# EAGLE design ATMegaBoard (EAGLE 9.5.0)
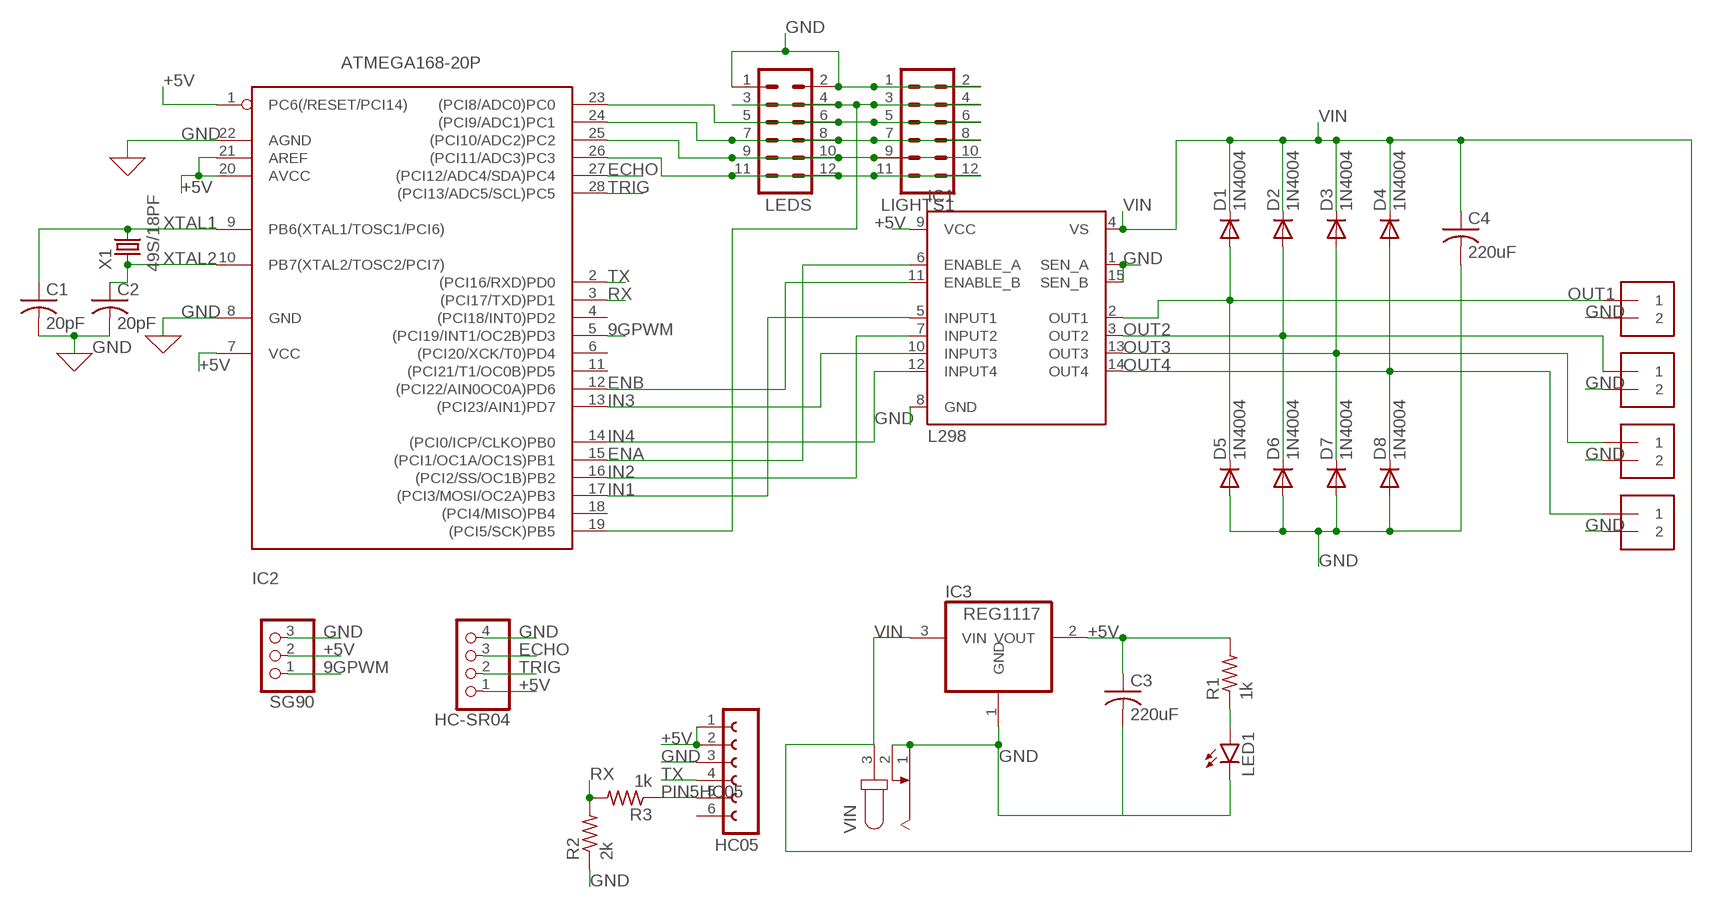
[diagram p0: schematic, sheet 1]

## Parts
C1  20pF  C-US050-024X044  [C050-024X044]
C2  20pF  C-US050-024X044  [C050-024X044]
C3  220uF  C-US050-024X044  [C050-024X044]
C4  220uF  C-US050-024X044  [C050-024X044]
D1  1N4004  [DO41-10]
D2  1N4004  [DO41-10]
D3  1N4004  [DO41-10]
D4  1N4004  [DO41-10]
D5  1N4004  [DO41-10]
D6  1N4004  [DO41-10]
D7  1N4004  [DO41-10]
D8  1N4004  [DO41-10]
HC05  FE06W  [FE06W]
HC-SR04  PINHD-1X4  [1X04]
IC1  L298  [MULTIWATT-15]
IC2  ATMEGA168-20P  [DIL28-3]
IC3  REG1117  [SOT223]
LED1  LED5MM  [LED5MM]
LEDS  MA06-2  [MA06-2]
LIGHTS1  MA06-2  [MA06-2]
OUT1  1X2-3.5MM  [1X2-3.5MM]
OUT2  1X2-3.5MM  [1X2-3.5MM]
OUT3  1X2-3.5MM  [1X2-3.5MM]
OUT4  1X2-3.5MM  [1X2-3.5MM]
R1  1k  R-US_0207/10  [0207/10]
R2  2k  R-US_0207/10  [0207/10]
R3  1k  R-US_0207/10  [0207/10]
SG90  PINHD-1X3  [1X03]
VIN  JACK-PLUG1  [SPC4078]
X1  49S/18PF  [XTAL_HC49]

## Nets
9GPWM: IC2.5((PCI19/INT1/OC2B)PD3) SG90.1
+5V [5v]: C3.1 HC05.1 HC05.2 HC-SR04.1 IC1.9(VCC) IC2.1(PC6(/RESET/PCI14)) IC2.7(VCC) IC2.20(AVCC) IC2.21(AREF) IC3.2(VOUT) R1.2 SG90.2
ECHO: HC-SR04.3 IC2.27((PCI12/ADC4/SDA)PC4)
ENA: IC1.6(ENABLE_A) IC2.15((PCI1/OC1A/OC1S)PB1)
ENB: IC1.11(ENABLE_B) IC2.12((PCI22/AIN0OC0A)PD6)
GND [Power]: C1.2 C2.2 C3.2 C4.2 D5.A D6.A D7.A D8.A HC05.3 HC-SR04.4 IC1.1(SEN_A) IC1.8(GND) IC1.15(SEN_B) IC2.8(GND) IC2.22(AGND) IC3.1(GND) LED1.K(C) LEDS.1 LEDS.2 LIGHTS1.1 LIGHTS1.2 OUT1.2 OUT2.2 OUT3.2 OUT4.2 R2.1 SG90.3 VIN.1 VIN.2
IN1: IC1.5(INPUT1) IC2.17((PCI3/MOSI/OC2A)PB3)
IN2: IC1.7(INPUT2) IC2.16((PCI2/SS/OC1B)PB2)
IN3: IC1.10(INPUT3) IC2.13((PCI23/AIN1)PD7)
IN4: IC1.12(INPUT4) IC2.14((PCI0/ICP/CLKO)PB0)
N$2: IC2.23((PCI8/ADC0)PC0) LEDS.5 LEDS.6 LIGHTS1.5 LIGHTS1.6
N$3: LED1.A R1.1
N$4: IC2.24((PCI9/ADC1)PC1) LEDS.7 LEDS.8 LIGHTS1.7 LIGHTS1.8
N$5: IC2.25((PCI10/ADC2)PC2) LEDS.9 LEDS.10 LIGHTS1.9 LIGHTS1.10
N$6: IC2.19((PCI5/SCK)PB5) LEDS.3 LEDS.4 LIGHTS1.3 LIGHTS1.4
N$7: IC2.26((PCI11/ADC3)PC3) LEDS.11 LEDS.12 LIGHTS1.11 LIGHTS1.12
OUT1 [Power]: D1.A D5.C IC1.2(OUT1) OUT1.1
OUT2 [Power]: D2.A D6.C IC1.3(OUT2) OUT2.1
OUT3 [Power]: D3.A D7.C IC1.13(OUT3) OUT3.1
OUT4 [Power]: D4.A D8.C IC1.14(OUT4) OUT4.1
PIN5HC05: HC05.5 R3.1
RX: IC2.3((PCI17/TXD)PD1) R2.2 R3.2
TRIG: HC-SR04.2 IC2.28((PCI13/ADC5/SCL)PC5)
TX: HC05.4 IC2.2((PCI16/RXD)PD0)
VIN [Power]: C4.1 D1.C D2.C D3.C D4.C IC1.4(VS) IC3.3(VIN) VIN.3
XTAL1: C1.1 IC2.9(PB6(XTAL1/TOSC1/PCI6)) X1.2
XTAL2: C2.1 IC2.10(PB7(XTAL2/TOSC2/PCI7)) X1.1
Unconnected: HC05.6 IC2.4((PCI18/INT0)PD2) IC2.6((PCI20/XCK/T0)PD4) IC2.11((PCI21/T1/OC0B)PD5) IC2.18((PCI4/MISO)PB4)

## Library data of the parts
C1-C4 = rcl:C-US: CAPACITOR, American symbol; SPICEPREFIX: C
D1-D8 = adafruit:1N4004: DIODE General purpose 1N400x type rectifier (With bigger pads) http://www.ladyada.net/library/pcb/eaglelibrary.html
HC05 = con-lsta:FE06W: FEMALE HEADER; OC_FARNELL: unknown; OC_NEWARK: unknown
HC-SR04 = pinhead:PINHD-1X4: PIN HEADER
IC1 = st-microelectronics:L298: DUAL FULL-BRIDGE DRIVER; MPN: L298N; OC_FARNELL: 1589425; OC_NEWARK: 32M1527
IC2 = adafruit:ATMEGA168*P: MICROCONTROLLER 16 kBytes FLASH 1 kBytes SRAM 512 Bytes EEPROM USART 8-channel 10 bit ADC
IC3 = burr-brown:REG1117: 800mA and 1A Low Dropout (LDO) Positive Regulator 1.8V, 2.5V, 2.85V, 3.3V, 5V, and Adj; MPN: REG1117; OC_FARNELL: 1097566; OC_NEWARK: 14P6981
LED1 = led:LED: LED OSRAM: - CHIPLED LG R971, LG N971, LY N971, LG Q971, LY Q971, LO R971, LY R971 LH N974, LH R974 LS Q976, LO Q976, LY Q976 LO Q996 - Hyper CHIPLED LW Q18S LB Q993, LB Q99A, LB R99A - SideLED LS A670, LO A670, LY A670, LG A670, LP A670 LB A673, LV A673, LT A673, LW A673 LH A674 LY A675 LS A676, LA A676, LO A676, LY A676, LW A676 LS A679, LY A679, LG A679 - Hyper Micro SIDELED® LS Y876, LA Y876, LO Y876, LY Y876 LT Y87S - SmartLED LW L88C, LW L88S LB L89C, LB L89S, LG L890 LS L89K, LO L89K, LY L89K LS L896, LA L896, LO L896, LY L896 - TOPLED LS T670, LO T670, LY T670, LG T670, LP T670 LSG T670, LSP T670, LSY T670, LOP T670, LYG T670 LG T671, LOG T671, LSG T671 LB T673, LV T673, LT T673, LW T673 LH T674 LS T676, LA T676, LO T676, LY T676, LB T676, LH T676, LSB T676, LW T676 LB T67C, LV T67C, LT T67C, LS T67K, LO T67K, LY T67K, LW E67C LS E67B, LA E67B, LO E67B, LY E67B, LB E67C, LV E67C, LT E67C LW T67C LS T679, LY T679, LG T679 LS T770, LO T770, LY T770, LG T770, LP T770 LB T773, LV T773, LT T773, LW T773 LH T774 LS E675, LA E675, LY E675, LS T675 LS T776, LA T776, LO T776, LY T776, LB T776 LHGB T686 LT T68C, LB T68C - Hyper Mini TOPLED® LB M676 - Mini TOPLED Santana® LG M470 LS M47K, LO M47K, LY M47K Source: http://www.osram.convergy.de LUXEON: - LUMILED® LXK2-PW12-R00, LXK2-PW12-S00, LXK2-PW14-U00, LXK2-PW14-V00 LXK2-PM12-R00, LXK2-PM12-S00, LXK2-PM14-U00 LXK2-PE12-Q00, LXK2-PE12-R00, LXK2-PE12-S00, LXK2-PE14-T00, LXK2-PE14-U00 LXK2-PB12-K00, LXK2-PB12-L00, LXK2-PB12-M00, LXK2-PB14-N00, LXK2-PB14-P00, LXK2-PB14-Q00 LXK2-PR12-L00, LXK2-PR12-M00, LXK2-PR14-Q00, LXK2-PR14-R00 LXK2-PD12-Q00, LXK2-PD12-R00, LXK2-PD12-S00 LXK2-PH12-R00, LXK2-PH12-S00 LXK2-PL12-P00, LXK2-PL12-Q00, LXK2-PL12-R00 Source: www.luxeon.com KINGBRIGHT: KA-3528ASYC Source: www.kingbright.com
LEDS LIGHTS1 = con-lstb:MA06-2: PIN HEADER; OC_FARNELL: unknown; OC_NEWARK: unknown
OUT1-OUT4 = adafruit:1X2: 3.5mm Terminal block http://www.ladyada.net/library/pcb/eaglelibrary.html
R1-R3 = rcl:R-US_: RESISTOR, American symbol; SPICEPREFIX: R
SG90 = pinhead:PINHD-1X3: PIN HEADER
VIN = con-jack:JACK-PLUG: DC POWER JACK Power Jack, DC, Right Angle, Through Hole, Rated 5A at 16VDC, PC Terminals Distributor: Farnell (www.Farnell.de) Drawing: 84N1161.pdf / 84N1162.pdf Manufacturer: SPC Technology (www.spctechnology.com) Type: SPC4077 / SPC 4078; OC_FARNELL: unknown; OC_NEWARK: unknown
X1 = Crystals:49S/18PF: Crystal Manufacturer's datasheet <https://datasheet.octopart.com/49S-18PF-Xinhunjing-datasheet-30677139.pdf>; CREATED_BY: PCBLayout.com; MANUFACTURER: Xinhunjing; MPN: 49S/18PF; PACKAGE: SMD

## Net classes
0 default: width 0.305 mm
1 Power: width 1.778 mm
2 5v: width 0.889 mm

## Board
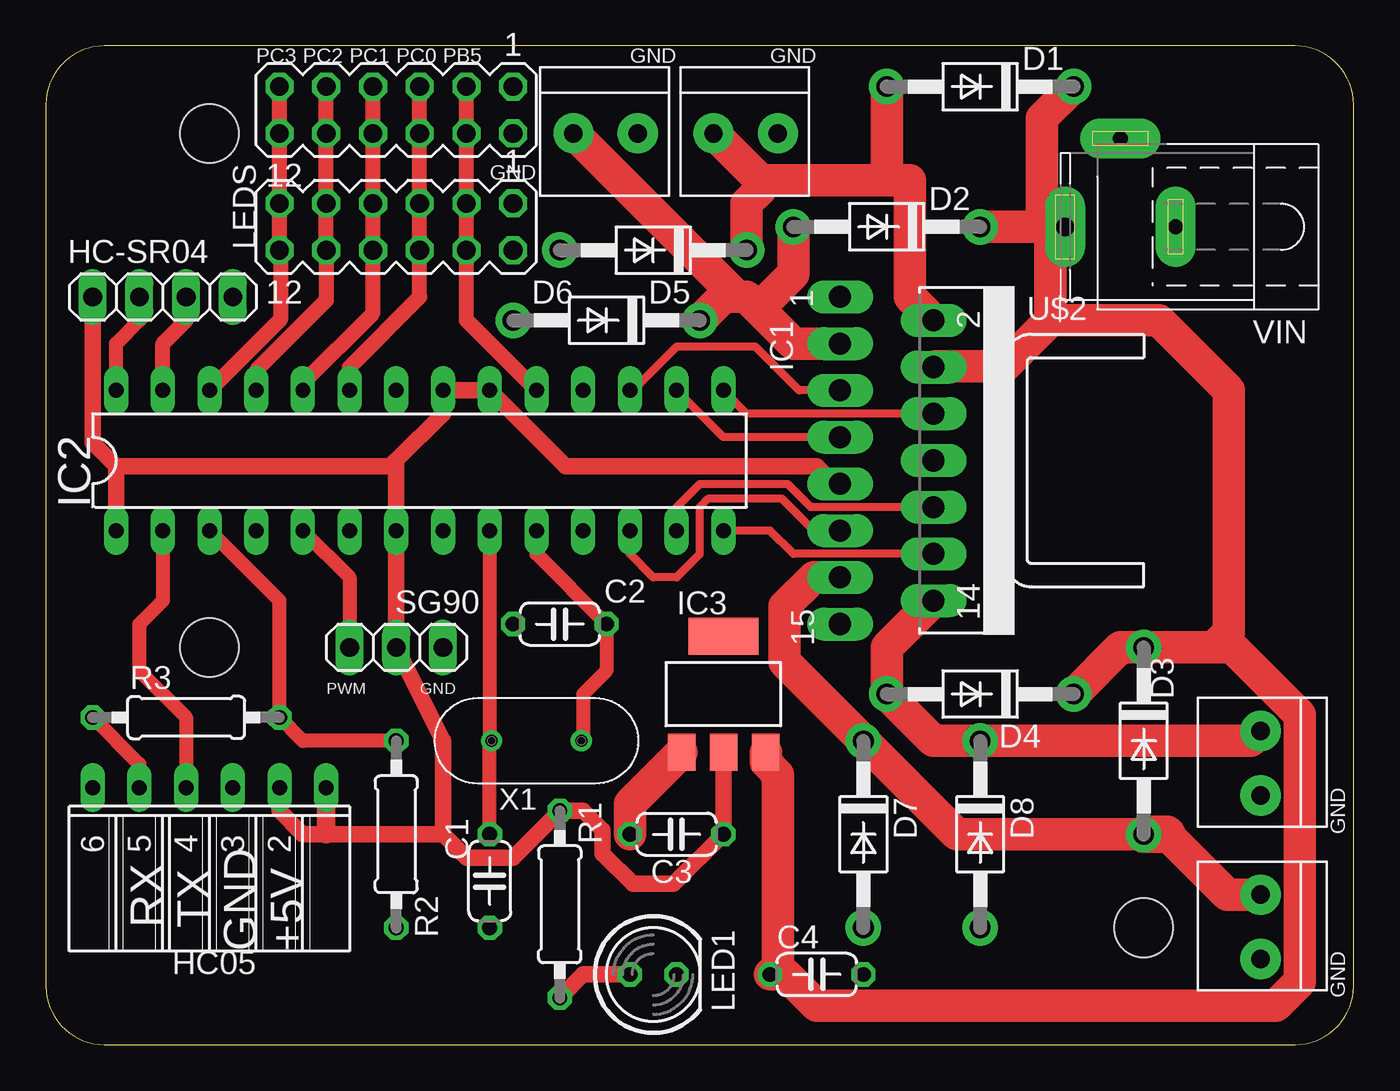
[diagram p1: board, top side]
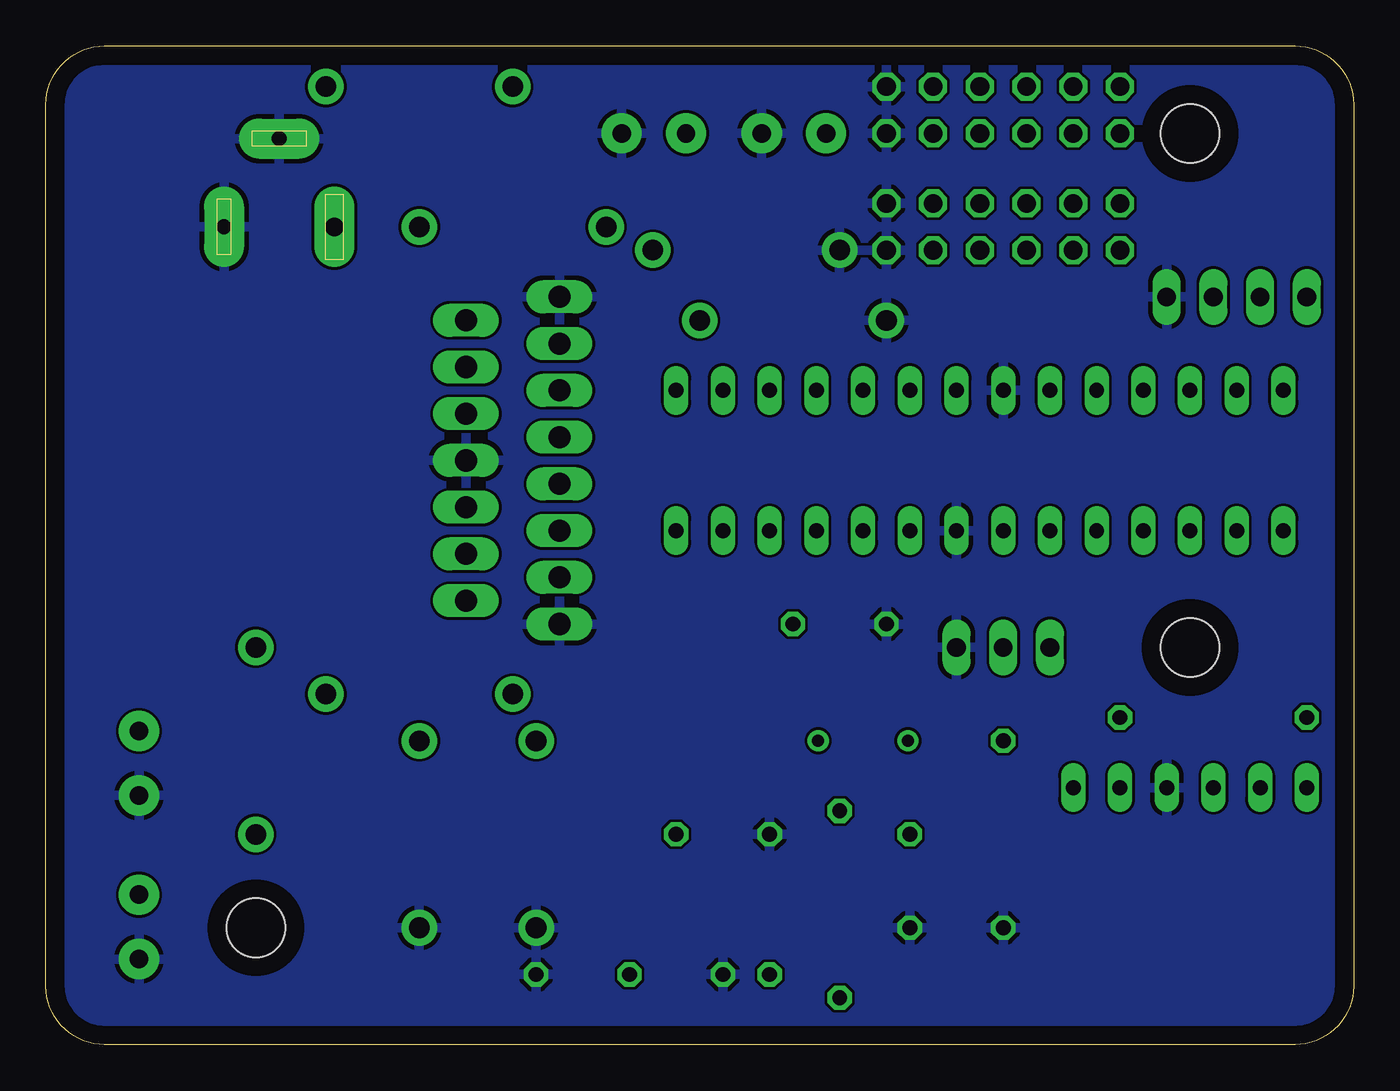
[diagram p2: board, bottom side, seen from below]

Size 71.1 x 54.28 mm. Coordinates in mm from the lower left corner, seen from the top.
Outline: 0,51.1 0,3.17 arc90 3.17,0 67.92,0 arc90 71.1,3.17 71.1,51.1 arc90 67.92,54.28 3.17,54.28 arc90 0,51.1
Copper layers (1*16): Top 0.035mm / dielectric 1.5mm / Bottom 0.035mm
Design rules "default *": minimum track width 16mil, minimum drill 0.35mm, track to track 6mil, track to pad 6mil, pad to pad 6mil, via to via 6mil, smd to smd 6mil, copper to edge 40mil, drill to drill 6mil, minimum pad ring 10mil, minimum via ring 8mil, stop-mask expansion 4mil, vias tented up to drill 0mil, thermal gap 10mil
Holes 3.2 mm at 59.69,6.35 8.89,21.59 8.89,49.53

### Footprints (pad centres in the part's own frame; a part is rotated, then mirrored left to right if it is on the bottom)
C050-024X044 = drill 0.813 octagon: 1 -2.54,0; 2 2.54,0
DO41-10 = drill 1.118 pad 1.93: A 5.08,0; C -5.08,0
FE06W = drill 0.813 long: 1 -6.35,0; 2 -3.81,0; 3 -1.27,0; 4 1.27,0; 5 3.81,0; 6 6.35,0
1X04 = drill 1.016 long: 1 -3.81,0; 2 -1.27,0; 3 1.27,0; 4 3.81,0
MULTIWATT-15 = drill 1.2 long: 1 -8.89,-7.62; 2 -7.62,-2.54; 3 -6.35,-7.62; 4 -5.08,-2.54; 5 -3.81,-7.62; 6 -2.54,-2.54; 7 -1.27,-7.62; 8 0,-2.54; 9 1.27,-7.62; 10 2.54,-2.54; 11 3.81,-7.62; 12 5.08,-2.54; 13 6.35,-7.62; 14 7.62,-2.54; 15 8.89,-7.62
DIL28-3 = drill 0.813 long: 1 -16.51,-3.81; 2 -13.97,-3.81; 3 -11.43,-3.81; 4 -8.89,-3.81; 5 -6.35,-3.81; 6 -3.81,-3.81; 7 -1.27,-3.81; 8 1.27,-3.81; 9 3.81,-3.81; 10 6.35,-3.81; 11 8.89,-3.81; 12 11.43,-3.81; 13 13.97,-3.81; 14 16.51,-3.81; 15 16.51,3.81; 16 13.97,3.81; 17 11.43,3.81; 18 8.89,3.81; 19 6.35,3.81; 20 3.81,3.81; 21 1.27,3.81; 22 -1.27,3.81; 23 -3.81,3.81; 24 -6.35,3.81; 25 -8.89,3.81; 26 -11.43,3.81; 27 -13.97,3.81; 28 -16.51,3.81
SOT223 = smd 1.499 x 2.007: 1 -2.261,-3.15; 2 0.025,-3.15; 3 2.311,-3.15 | smd 3.81 x 2.007: 4 0,3.15
LED5MM = drill 0.813 octagon: A -1.27,0; K 1.27,0
MA06-2 = drill 1.016 octagon: 1 -6.35,-1.27; 2 -6.35,1.27; 3 -3.81,-1.27; 4 -3.81,1.27; 5 -1.27,-1.27; 6 -1.27,1.27; 7 1.27,-1.27; 8 1.27,1.27; 9 3.81,-1.27; 10 3.81,1.27; 11 6.35,-1.27; 12 6.35,1.27
1X2-3.5MM = drill 1 pad 2.184: 1 1.8,0; 2 -1.7,0
0207/10 = drill 0.813 octagon: 1 -5.08,0; 2 5.08,0
1X03 = drill 1.016 long: 1 -2.54,0; 2 0,0; 3 2.54,0
SPC4078 = drill 0.8 pad 2.184 long: 1 -3,0; 2 0,-4.8 | drill 1 pad 2.184 long: 3 3,0
XTAL_HC49 = drill 0.65 pad 1.05: 1 -2.44,0; 2 2.44,0

### Placement (x,y rotation side)
C1  24.13,8.89 270 top
C2  27.94,22.86 180 top
C3  34.29,11.43 180 top
C4  41.91,3.81 0 top
D1  50.8,52.07 180 top
D2  45.72,44.45 180 top
D3  59.69,16.51 270 top
D4  50.8,19.05 180 top
D5  33.02,43.18 180 top
D6  30.48,39.37 180 top
D7  44.45,11.43 270 top
D8  50.8,11.43 270 top
HC05  8.89,13.97 180 top
HC-SR04  6.35,40.64 0 top
IC1  50.8,31.75 270 top
IC2  20.32,31.75 0 top
IC3  36.83,19.05 0 top
LED1  33.02,3.81 0 top
LEDS  19.05,50.8 180 top
LIGHTS1  19.05,44.45 180 top
OUT1  38.1,49.53 180 top
OUT2  30.48,49.53 180 top
OUT3  66.04,6.35 90 top
OUT4  66.04,15.24 90 top
R1  27.94,7.62 90 top
R2  19.05,11.43 90 top
R3  7.62,17.78 0 top
SG90  19.05,21.59 0 top
U$2  [D03S]  53.34,31.75 270 top
VIN  58.42,44.45 180 top
X1  26.67,16.51 180 top

### Tracks (layer width: path | path; a pad name or v marks a point on that pad's centre or on a via)
9GPWM
  Top 0.762: IC2.5 16.51,25.4 SG90.1
+5V
  Top 0.889: HC-SR04.1 2.54,32.7 3.81,31.43 | HC05.2 12.7,12.7 13.97,11.43 15.24,11.43 21.59,11.43 | 21.59,11.43 21.59,16.51 SG90.2 IC2.7 19.05,31.75 | IC1.9 42.86,30.48 41.91,31.43 28.26,31.43 IC2.20 IC2.21 21.59,34.29 19.05,31.75 | 19.05,31.75 18.73,31.43 3.81,31.43 | IC3.2 36.83,15.88 C3.1 34.13,8.73 31.91,8.73 30.26,10.38 30.26,11.65 29.21,12.7 R1.2 25.4,10.16 22.86,10.16 21.59,11.43 | IC2.1 3.81,31.43
  Top 1.016: HC05.1 15.24,11.43
ECHO
  Top 0.813: IC2.27 6.35,38.1 7.62,39.37 HC-SR04.3
ENA
  Top 0.432: IC2.15 38.1,34.29 IC1.6
ENB
  Top 0.432: IC1.11 41.75,27.94 40.01,29.69 36.04,29.69 35.56,29.21 35.56,26.67 34.29,25.4 33.02,25.4 31.75,26.67 IC2.12
GND
  Top 1.778: C3.2 31.75,13.08 IC3.1
  pour Bottom: 0,3.17 0,50.16 arc-90 3.17,53.34 67.94,53.34 arc-90 71.12,50.16 71.12,3.17 arc-90 67.94,0 3.17,0 arc-90
IN1
  Top 0.406: IC2.17 31.91,35.56
  Top 0.432: IC1.5 40.96,35.56 38.58,37.94 34.29,37.94 31.91,35.56
IN2
  Top 0.432: IC2.16 36.83,33.02 IC1.7
IN3
  Top 0.432: IC1.10 41.59,29.21 40.32,30.48 35.56,30.48 34.29,29.21 IC2.13
IN4
  Top 0.432: IC1.12 40.64,26.67 39.37,27.94 IC2.14
N$2
  Top 0.813: IC2.23 16.51,36.83 20.32,40.64 LIGHTS1.6 LIGHTS1.5 LEDS.6 LEDS.5
N$3
  Top 0.889: R1.1 29.21,3.81 LED1.A
N$4
  Top 0.813: IC2.24 13.97,35.95 17.78,39.76 LIGHTS1.8 LIGHTS1.7 LEDS.8 LEDS.7
N$5
  Top 0.813: IC2.25 11.43,36.65 15.24,40.45 LIGHTS1.10 LIGHTS1.9 LEDS.10 LEDS.9
N$6
  Top 0.813: IC2.19 22.86,39.37 LIGHTS1.4 LIGHTS1.3 LEDS.4 LEDS.3
N$7
  Top 0.813: LEDS.11 LEDS.12 LIGHTS1.11 LIGHTS1.12 12.75,43.13 12.75,39.42 IC2.26
OUT1
  Top 1.778: IC1.2 46.99,40.64 46.99,46.99 45.72,46.99 | D5.C 38.1,45.72 38.84,46.46 38.84,46.99 | 45.72,46.99 38.84,46.99 | OUT1.1 38.84,46.99 | 45.72,46.99 D1.A
OUT2
  Top 1.778: 37.57,40.64 36.83,40.64 D6.C | 37.57,40.64 38.1,40.64 38.73,40.01 | 38.73,40.01 40.64,38.1 IC1.3 | D2.A 40.64,41.91 38.73,40.01 | 37.57,40.64 OUT2.1
OUT3
  Top 1.778: IC1.13 41.75,25.4 40.16,23.81 40.16,20.8 D7.C 49.53,11.43 D3.A | OUT3.1 64.24,8.15 60.96,11.43
  Top 2.032: D3.A 60.96,11.43
OUT4
  Top 1.778: IC1.14 45.72,21.59 D4.A 48.26,16.51 D8.C 65.51,16.51 OUT4.1
PIN5HC05
  Top 0.762: HC05.5 5.08,15.24 R3.1
RX
  Top 0.762: R2.2 13.97,16.51 R3.2 12.7,24.13 IC2.3
TRIG
  Top 0.762: HC-SR04.2 5.08,39.37 3.81,38.1 IC2.28
TX
  Top 0.762: IC2.2 6.35,24.13 5.08,22.86 5.08,20.32 7.62,17.78 HC05.4
VIN
  Top 1.778: IC1.4 48.36,36.87 52.11,36.87 54.61,39.37 | IC3.3 39.14,15.34 39.8,14.68 39.8,4.24 C4.1 40.21,3.81 41.91,2.11 66.88,2.11 68.17,3.4 68.17,17.92 64.51,21.59 63.5,21.59 | 54.61,39.37 54.61,44.45 | D2.C 54.61,44.45 | 54.61,39.37 60.5,39.37 64.31,35.56 64.31,22.4 63.5,21.59 | 54.61,44.45 VIN.3 54.15,44.45 54.15,50.34 D1.C | D4.C 58.42,21.59 D3.C 63.5,21.59
XTAL1
  Top 0.762: IC2.9 24.13,16.61 X1.2 24.13,16.41 C1.1
XTAL2
  Top 0.762: X1.1 29.21,16.61 29.21,19.05 30.48,20.32 C2.1 26.67,26.67 IC2.10

### Text on the board
tPlace: PB5 | GND | GND | GND | PWM | GND | GND | RX | TX | GND | +5V | GND
tNames: PC3 | PC2 | PC1 | PC0
tValues: OUT2 | OUT1 | OUT4 | OUT3